# EAGLE design Four_Sensors_V2 (EAGLE 9.5.2)
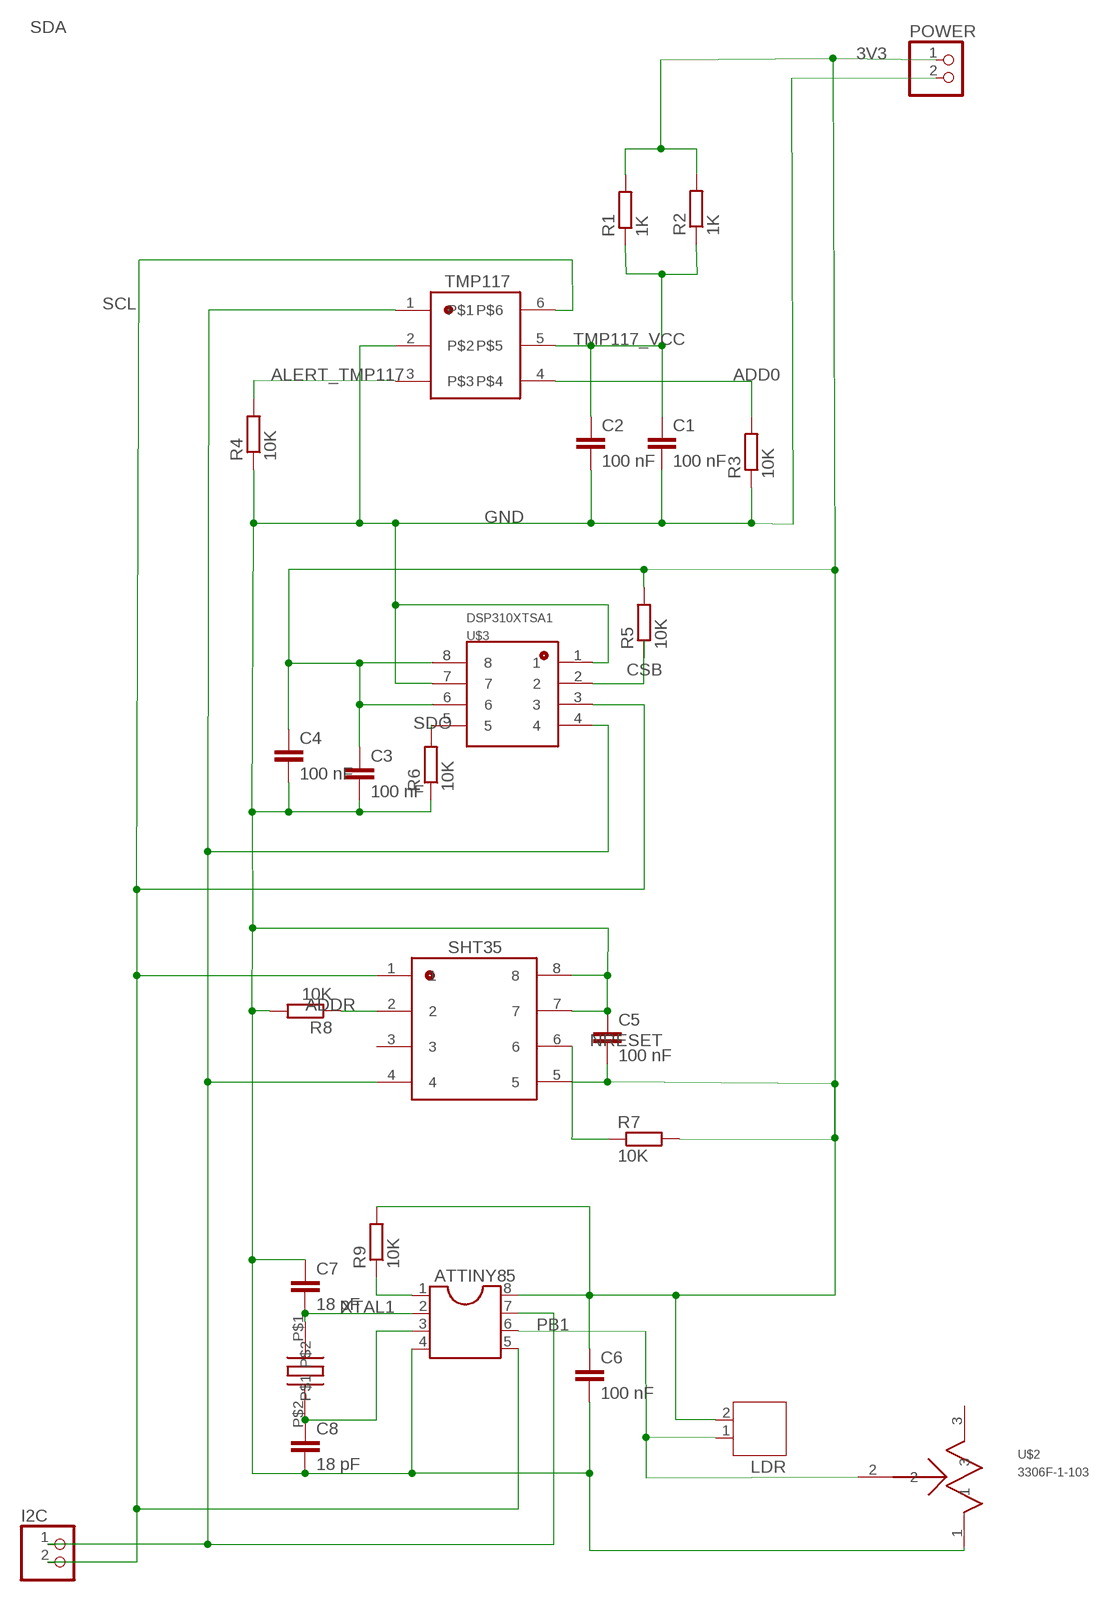
[diagram p0: schematic, sheet 1]

## Parts
ATTINY85  DIL8  [DIL08]
C1  100 nF  C-EUC0603  [C0603]
C2  100 nF  C-EUC0603  [C0603]
C3  100 nF  C-EUC0603  [C0603]
C4  100 nF  C-EUC0603  [C0603]
C5  100 nF  C-EUC0603  [C0603]
C6  100 nF  C-EUC0603  [C0603]
C7  18 pF  C-EUC0805  [C0805]
C8  18 pF  C-EUC0805  [C0805]
I2C  PINHD-1X2  [1X02]
LDR  JST-PH2  [JST-PH2]
POWER  PINHD-1X2  [1X02]
R1  1K  R-EU_R1206  [R1206]
R2  1K  R-EU_R1206  [R1206]
R3  10K  R-EU_R0805  [R0805]
R4  10K  R-EU_R0805  [R0805]
R5  10K  R-EU_R0805  [R0805]
R6  10K  R-EU_R0805  [R0805]
R7  10K  R-EU_R0805  [R0805]
R8  10K  R-EU_R0805  [R0805]
R9  10K  R-EU_R0805  [R0805]
SHT35  SHT35  [SHT35]
TMP117  TMP117  [TMP117]
U$1  QCL16.0000F18B23B  [QCL16.0000F18B23B]
U$2  3306F-1-103  [3306F-1-103]
U$3  DSP310XTSA1  [DSP310XTSA1]

## Nets
3V3: ATTINY85.8 C3.1 C4.1 C5.2 C6.1 LDR.2 POWER.1 R1.2 R2.2 R5.2 R7.2 R9.2 SHT35.5 U$3.6 U$3.8
ADD0: R3.2 TMP117.4
ADDR: R8.1 SHT35.2
ALERT_TMP117: R4.2 TMP117.3
CSB: R5.1 U$3.2
GND: ATTINY85.4 C1.2 C2.2 C3.2 C4.2 C5.1 C6.2 C7.1 C8.2 POWER.2 R3.1 R4.1 R6.1 R8.2 SHT35.7 SHT35.8 TMP117.2 U$2.1 U$3.1 U$3.7
NRESET: R7.1 SHT35.6
PB1: ATTINY85.6 LDR.1 U$2.2
PB5: ATTINY85.1 R9.1
SCL: ATTINY85.7 I2C.1 SHT35.4 TMP117.1 U$3.4
SDA: ATTINY85.5 I2C.2 SHT35.1 TMP117.6 U$3.3
SDO: R6.2 U$3.5
TMP117_VCC: C1.1 C2.1 R1.1 R2.1 TMP117.5
XTAL1: ATTINY85.2 C7.2 U$1.P$1
XTAL2: ATTINY85.3 C8.1 U$1.P$2
Unconnected: SHT35.3 U$2.3

## Library data of the parts
ATTINY85 = ic-package:DIL8: Dual In Line / Socket
C1-C8 = rcl:C-EU: CAPACITOR, European symbol; SPICEPREFIX: C
I2C POWER = pinhead:PINHD-1X2: PIN HEADER
LDR = jst-ph:JST-PH2
R1-R9 = rcl:R-EU_: RESISTOR, European symbol; SPICEPREFIX: R
SHT35 = Library:SHT35
TMP117 = Library:TMP117
U$1 = Library:QCL16.0000F18B23B: 16 MHz Crystal
U$2 = Library:3306F-1-103: 10 Kohm Trimmer Potentiometer
U$3 = Library:DSP310XTSA1

## Board
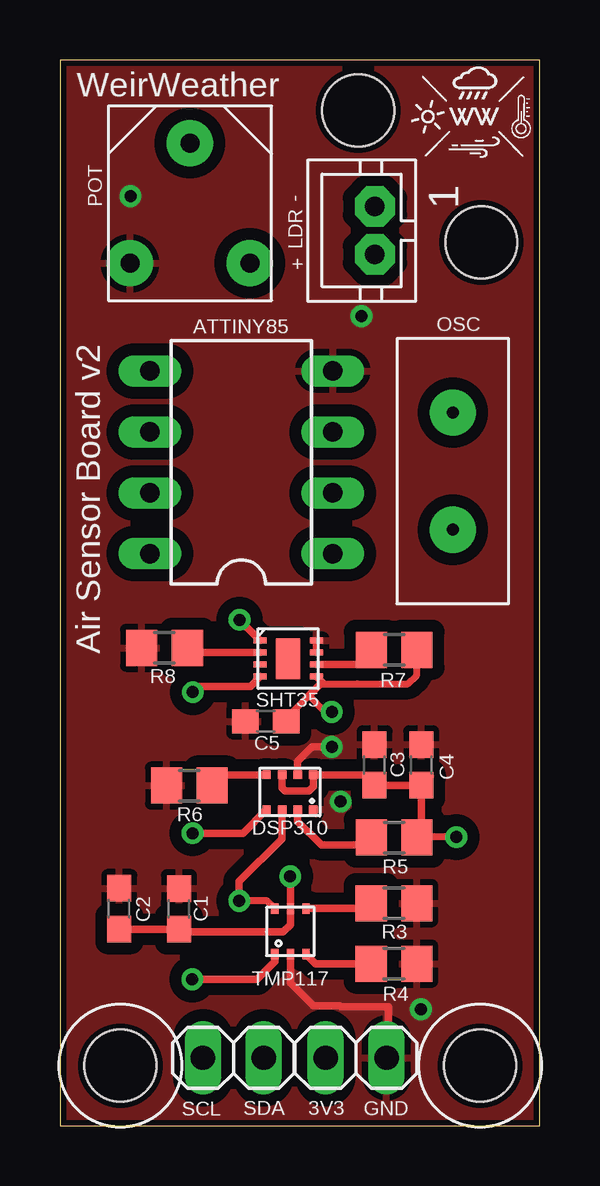
[diagram p1: board, top side]
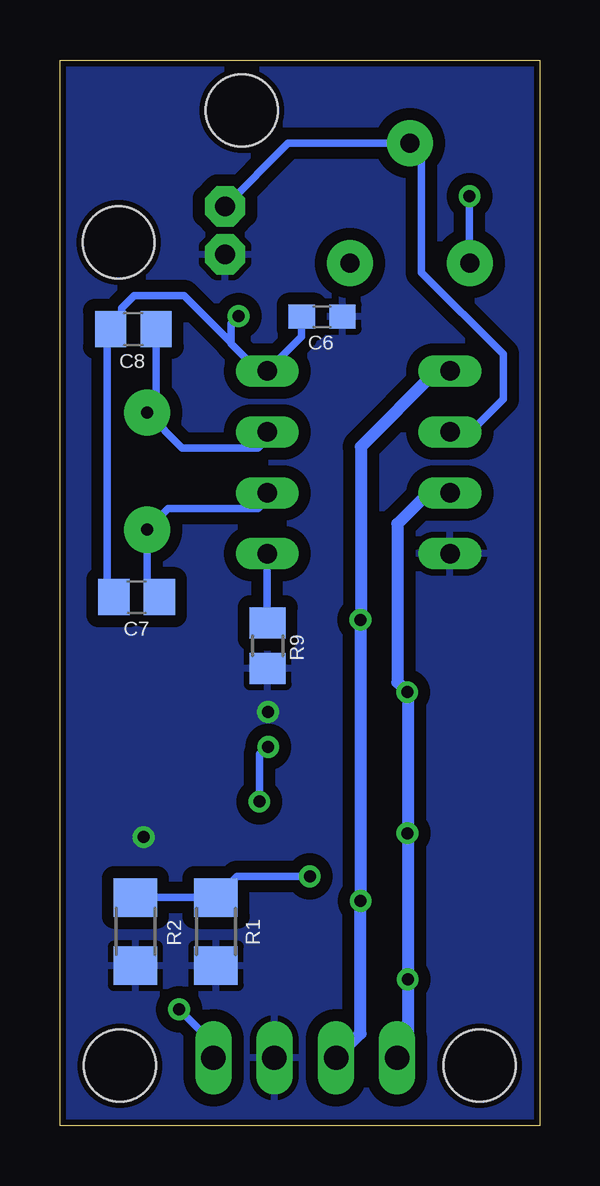
[diagram p2: board, bottom side, seen from below]

Size 20.02 x 44.42 mm. Coordinates in mm from the lower left corner, seen from the top.
Outline: 0.02,0 20.02,0 20,44.42 0,44.42 0.02,0
Copper layers (1*16): Top 0.035mm / dielectric 1.5mm / Bottom 0.035mm
Design rules "default *": minimum track width 0.3mm, minimum drill 0.5mm, track to track 0.5mm, track to pad 0.5mm, pad to pad 0.5mm, via to via 0.5mm, smd to smd 0.5mm, copper to edge 10mil, drill to drill 10mil, minimum pad ring 10mil, minimum via ring 8mil, stop-mask expansion 4mil, vias tented up to drill 0mil, thermal gap 10mil
Holes 3 mm at 2.52,2.5 17.52,2.5 17.57,36.82 12.44,42.32

### Footprints (pad centres in the part's own frame; a part is rotated, then mirrored left to right if it is on the bottom)
DIL08 = drill 0.813 long: 1 -3.81,-3.81; 2 -1.27,-3.81; 3 1.27,-3.81; 4 3.81,-3.81; 5 3.81,3.81; 6 1.27,3.81; 7 -1.27,3.81; 8 -3.81,3.81
C0603 = smd 1.1 x 1: 1 -0.85,0; 2 0.85,0
C0805 = smd 1.3 x 1.5: 1 -0.95,0; 2 0.95,0
1X02 = drill 1.016 long: 1 -1.27,0; 2 1.27,0
JST-PH2 = drill 0.813 pad 1.676 octagon: 1 1,0; 2 -1,0
R1206 = smd 1.6 x 1.803: 1 -1.422,0; 2 1.422,0
R0805 = smd 1.3 x 1.5: 1 -0.95,0; 2 0.95,0
SHT35 = smd 0.55 x 0.25: 1 -1.175,0.75; 2 -1.175,0.25; 3 -1.175,-0.25; 4 -1.175,-0.75; 5 1.175,-0.75; 6 1.175,-0.25; 7 1.175,0.25; 8 1.175,0.75 | smd 1 x 1.7: P$9 0,0
TMP117 = smd 0.45 x 0.3: 1 -0.95,0.65; 2 -0.95,0; 3 -0.95,-0.65; 4 0.95,-0.65; 5 0.95,0; 6 0.95,0.65
QCL16.0000F18B23B = drill 0.5 pad 1.93: P$1 -2.44,0; P$2 2.44,0
3306F-1-103 = drill 0.8 pad 1.93: 1 -2.5,-2.5; 2 0,2.5; 3 2.5,-2.5
DSP310XTSA1 = smd 0.35 x 0.35: 1 -0.975,0.725; 2 -0.325,0.725; 3 0.325,0.725; 4 0.975,0.725; 5 0.975,-0.725; 6 0.325,-0.725; 7 -0.325,-0.725; 8 -0.975,-0.725

### Placement (x,y rotation side)
ATTINY85  7.57,27.65 90 top
C1  4.96,9.04 90 top
C2  2.47,9.05 90 top
C3  13.12,15.04 90 top
C4  15.07,15.04 90 top
C5  8.58,16.85 0 top
C6  9.09,33.72 180 bottom
C7  16.82,22.03 0 bottom
C8  16.96,33.21 180 bottom
I2C  7.23,2.83 0 top
LDR  13.13,37.32 90 top
POWER  12.35,2.83 0 top
R1  13.51,8.09 270 bottom
R2  16.87,8.09 270 bottom
R3  13.93,9.27 180 top
R4  13.93,6.75 180 top
R5  13.94,12.01 0 top
R6  5.4,14.18 0 top
R7  13.94,19.83 0 top
R8  4.36,19.92 180 top
R9  11.35,20.01 270 bottom
SHT35  9.52,19.47 0 top
TMP117  9.61,8.1 90 top
U$1  16.39,27.29 90 top
U$2  5.42,38.45 0 top
U$3  9.59,13.91 180 top

### Tracks (layer width: path | path; a pad name or v marks a point on that pad's centre or on a via)
3V3  (via drill 0.5)
  Top 0.3: 11,18.41 12.38,18.41 12.39,18.41 14.52,18.41 14.88,18.77 14.88,19.64 | C5.2 9.43,16.98 10.38,17.93 11.06,17.25 v11.34,17.25 | v16.53,12.03 14.9,12.03 R5.2
  Top 0.305: U$3.6 9.27,14.08 9.39,13.96 10.39,13.96 10.57,14.14 U$3.8 12.68,14.63 C3.1 C4.1 | C4.1 15.07,12.2 R5.2 | C5.2 9.2,17.09 | 14.67,19.29 14.66,19.28 14.66,19.61 R7.2 | C4.1 15.44,14.56 | SHT35.5 11,18.41 10.86,18.41 10.38,17.93
  Top 0.5: 14.88,19.64 R7.2
  pour Bottom: 0.04,44.29 20.02,44.29 20.02,0 0.04,0
ADD0
  Top 0.305: TMP117.4 12.76,9.05 R3.2
ADDR
  Top 0.3: 5.8,19.86 R8.1
  Top 0.305: SHT35.2 5.51,19.72 R8.1
ALERT_TMP117
  Top 0.305: R4.2 10.66,6.75 TMP117.3
CSB
  Top 0.305: U$3.2 9.92,12.69 10.9,11.7 12.68,11.7 R5.1
GND  (via drill 0.5)
  Top 0.3: SHT35.7 SHT35.8
  Top 0.305: TMP117.2 9.61,5.96 10.56,5.01 11.67,5.01 11.72,4.95 13.69,4.95 13.69,2.9 POWER.2 | U$3.7 9.92,15.18 10.52,15.79 v11.34,15.79
  Top 0.5: 3.3,20.36 R8.2 3.3,19.86
  Bottom 0.305: v11.34,15.79 11.41,15.79 11.7,15.49 v11.7,13.51 | C7.1 18.05,22.3 18.05,32.68 17.91,32.82 C8.2 17.45,33.67 17.45,34.09 16.93,34.61 14.84,34.61 12.88,32.65 | v12.57,33.74 12.88,33.43 12.88,32.65 | 12.88,32.65 12.88,32.6 11.74,31.46 ATTINY85.4 9.94,32.9 C6.2 | v2.94,38.74 2.94,35.97 U$2.1 | v15.05,4.86 13.62,3.42 POWER.2
  pour Top: 0.04,44.26 20.02,44.26 20.02,0 0.04,0
NRESET
  Top 0.3: 12.88,20.14 R7.1
  Top 0.305: SHT35.6 12.37,19.22 R7.1
PB1
  Bottom 0.305: ATTINY85.6 2.91,28.92 1.53,30.3 1.53,32.16 4.94,35.56 4.94,40.47 U$2.2 10.5,40.95 LDR.1
PB5
  Bottom 0.305: ATTINY85.1 11.38,20.98 R9.1
SCL  (via drill 0.5)
  Top 0.305: v5.52,6.1 8.21,6.1 8.96,6.85 TMP117.1 | U$3.4 7.63,12.19 v5.53,12.19 | SHT35.4 7.94,18.32 5.78,18.32 v5.54,18.07
  Bottom 0.305: v5.53,12.19 v5.53,6.11 v5.52,6.1 | v5.54,18.07 5.54,17.91 5.52,17.9
  Bottom 0.5: I2C.1 5.52,3.27 v5.52,6.1 5.52,12.47 5.52,17.9 | 5.96,25.09 5.96,18.49 v5.54,18.07
  Bottom 0.508: ATTINY85.7 4.66,26.38 5.96,25.09 | v5.53,12.19 5.53,12.46 5.52,12.47
SDA  (via drill 0.5)
  Top 0.3: TMP117.6 8.63,9.38 v7.48,9.38
  Top 0.305: U$3.3 9.27,11.96 7.48,10.18 v7.48,9.38 | SHT35.1 7.49,21.07 v7.49,21.09
  Bottom 0.5: I2C.2 7.48,3.85 v7.48,9.37 | v7.49,21.09 7.48,21.1 | v7.49,9.38 v7.48,9.38
  Bottom 0.508: v7.48,9.38 v7.48,9.37 v7.49,9.38 v7.49,21.09 | ATTINY85.5 4.31,31.46 7.48,28.3 7.48,21.1
SDO
  Top 0.305: R6.2 6.55,14.39 6.76,14.6 6.8,14.63 U$3.5
TMP117_VCC  (via drill 0.5)
  Top 0.305: C2.1 C1.1 5.08,8.07 9.3,8.07 9.61,8.38 TMP117.5 v9.61,10.38 v9.6,10.39
  Bottom 0.305: v9.6,10.39 12.64,10.39 R1.1 R2.1
  Bottom 0.61: R2.1
XTAL1
  Bottom 0.305: ATTINY85.2 11.38,26.11 11.76,25.72 15.52,25.72 U$1.P$1 16.39,22.55 C7.2
XTAL2
  Bottom 0.305: ATTINY85.3 11.38,28.65 11.76,28.26 14.92,28.26 U$1.P$2 16.01,30.11 C8.1

### Text on the board
tNames: WeirWeather | - | POT | + | OSC | Air Sensor Board v2 | DSP310 | SCL | SDA | 3V3 | GND